# Altium project gclk_a.PrjPCB
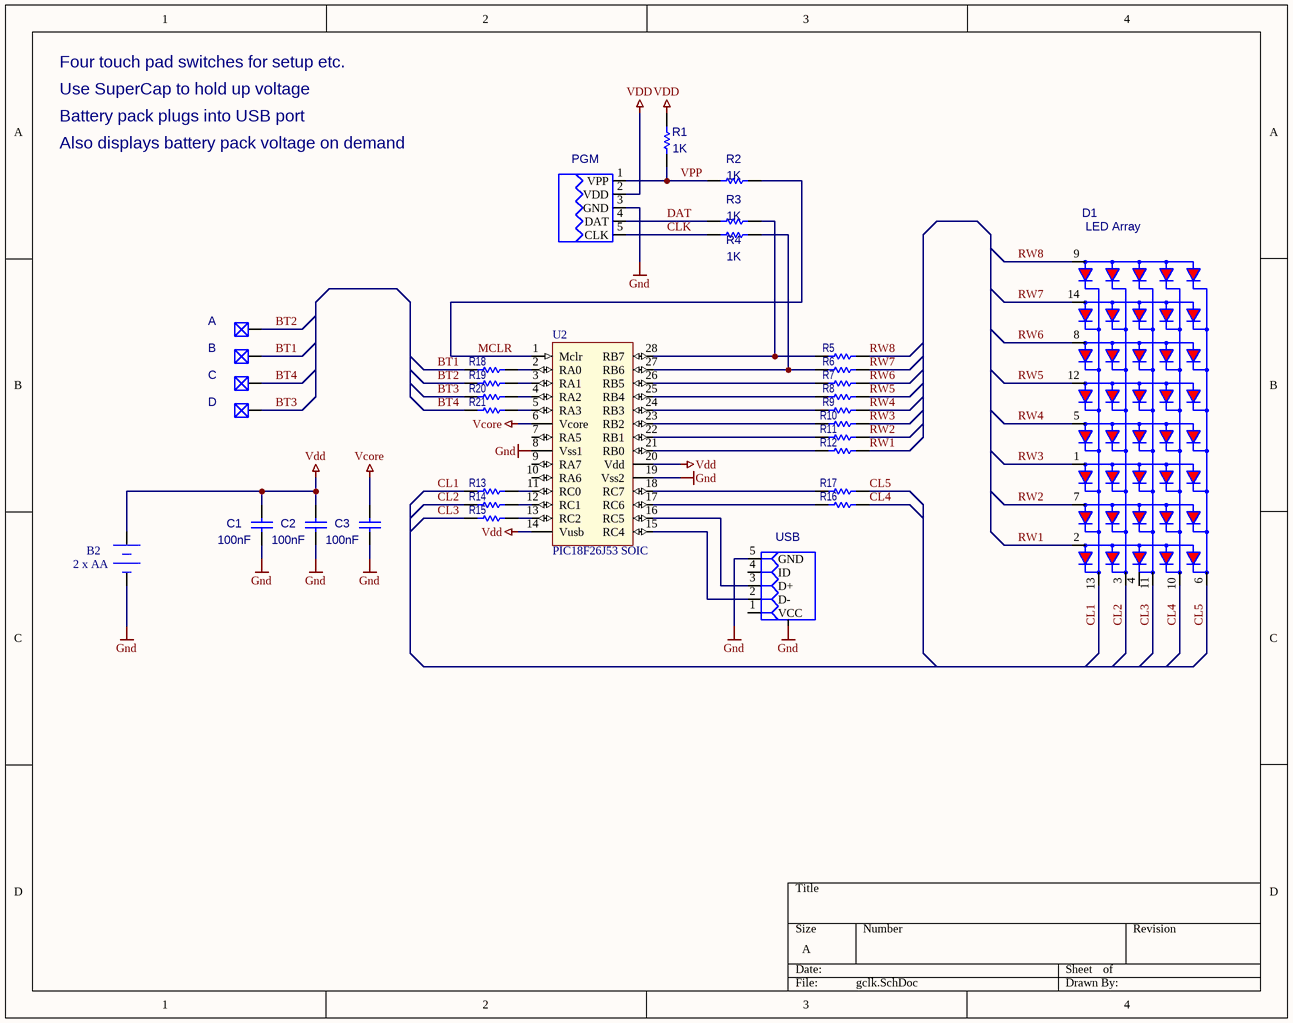
[diagram p0: gclk.SchDoc]
1 sheet, 33 parts. Net scope: global (net labels, ports and power ports of the same name join across sheets).
Board file: gclk.PcbDoc

## Sheet gclk.SchDoc
size A

### Parts
A  PAD143-190-12GA  [PAD143-190-12GA]  (value not drawn)
B  PAD143-190-12GA  [PAD143-190-12GA]  (value not drawn)
B2  2 x AA  [BC2AAPC]
C  PAD143-190-12GA  [PAD143-190-12GA]  (value not drawn)
C1  value 100nF  [CAPC0805(2012)145_N]  (hidden comment: CAP 100nF 50V 0805(2012))
C2  value 100nF  [CAPC0805(2012)145_N]  (hidden comment: CAP 100nF 50V 0805(2012))
C3  value 100nF  [CAPC0805(2012)145_N]  (hidden comment: CAP 100nF 50V 0805(2012))
D  PAD143-190-12GA  [PAD143-190-12GA]  (value not drawn)
D1  LED Array  [LTP-2158]
PGM  Program Header  [ProgHeader_100]  (value not drawn)
R1  1K  [RESC0603(1608)_L]
R2  1K  [RESC0603(1608)_L]
R3  1K  [RESC0603(1608)_L]
R4  1K  [RESC0603(1608)_L]
R5  100R  [RESC0603(1608)_L]  (value not drawn)
R6  100R  [RESC0603(1608)_L]  (value not drawn)
R7  100R  [RESC0603(1608)_L]  (value not drawn)
R8  100R  [RESC0603(1608)_L]  (value not drawn)
R9  100R  [RESC0603(1608)_L]  (value not drawn)
R10  100R  [RESC0603(1608)_L]  (value not drawn)
R11  100R  [RESC0603(1608)_L]  (value not drawn)
R12  100R  [RESC0603(1608)_L]  (value not drawn)
R13  100R  [RESC0603(1608)_L]  (value not drawn)
R14  100R  [RESC0603(1608)_L]  (value not drawn)
R15  100R  [RESC0603(1608)_L]  (value not drawn)
R16  100R  [RESC0603(1608)_L]  (value not drawn)
R17  100R  [RESC0603(1608)_L]  (value not drawn)
R18  100R  [RESC0603(1608)_L]  (value not drawn)
R19  100R  [RESC0603(1608)_L]  (value not drawn)
R20  100R  [RESC0603(1608)_L]  (value not drawn)
R21  100R  [RESC0603(1608)_L]  (value not drawn)
U2  PIC18F26J53 SOIC  [Microchip SOIC 28 Wide]
USB  USB  [105133-0001]  (value not drawn)

### Nets
Gnd: B2.0 B2.2(-) C1.1 C2.1 C3.1 PGM.3(GND) U2.8(Vss1) U2.19(Vss2) USB.0 USB.5(GND)
Vcore: C3.2 U2.6(Vcore)
VDD: B2.1(+) C1.2 C2.2 PGM.2(VDD) R1.2 U2.14(Vusb) U2.20(Vdd)
BT1: B.1 R18.1
BT2: A.1 R19.1
BT3: D.1 R20.1
BT4: C.1 R21.1
CL1: D1.13 R13.1
CL2: D1.3 R14.1
CL3: D1.11 R15.1
CL4: D1.10 R16.2
CL5: D1.6 R17.2
CLK: PGM.5(CLK) R4.2
DAT: PGM.4(DAT) R3.2
MCLR: R2.1 U2.1(Mclr)
RW1: D1.2 R12.2
RW2: D1.7 R11.2
RW3: D1.1 R10.2
RW4: D1.5 R9.2
RW5: D1.12 R8.2
RW6: D1.8 R7.2
RW7: D1.14 R6.2
RW8: D1.9 R5.2
VPP: PGM.1(VPP) R1.1 R2.2
NetR3_1: R3.1 R5.1 U2.28(RB7)
NetR4_1: R4.1 R6.1 U2.27(RB6)
NetR7_1: R7.1 U2.26(RB5)
NetR8_1: R8.1 U2.25(RB4)
NetR9_1: R9.1 U2.24(RB3)
NetR10_1: R10.1 U2.23(RB2)
NetR11_1: R11.1 U2.22(RB1)
NetR12_1: R12.1 U2.21(RB0)
NetR13_2: R13.2 U2.11(RC0)
NetR14_2: R14.2 U2.12(RC1)
NetR15_2: R15.2 U2.13(RC2)
NetR16_1: R16.1 U2.17(RC6)
NetR17_1: R17.1 U2.18(RC7)
NetR18_2: R18.2 U2.2(RA0)
NetR19_2: R19.2 U2.3(RA1)
NetR20_2: R20.2 U2.4(RA2)
NetR21_2: R21.2 U2.5(RA3)
NetU2_15: U2.15(RC4) USB.2(D-)
NetU2_16: U2.16(RC5) USB.3(D+)

Not connected (* = marked no-connect by the designer): D1 4; U2 7(RA5) 9(RA7) 10(RA6); USB 1(VCC) 4(ID)

### Notes on the sheet
- Use SuperCap to hold up voltage
- Four touch pad switches for setup etc.
- Battery pack plugs into USB port
- Also displays battery pack voltage on demand

### Library data of the parts
B2 = BC2AAPC: Battery Holder
C1-C3 = CMP-1036-04422-1: CAP 100nF 50V ±20% 0805 (2012 Metric) Thickness 1.45mm SMD; Case-Metric: 2012; Case-EIA: 0805; AS P/N: ASC_100n_0805; Tolerance: ±20%; Max Thickness: 1.45 mm; Technology: SMT; Rated Voltage: 50 V
D1 = LTP-2158: LED Matrix 5x8 2.3" Hi Effeciency Red; ModifyDate: 11/19/2010 06:25:10
PGM = ProgHeader_100: Programming header, 0.100" centres
R1-R4 = CMP-1012-00510-1: 1K 0.1W 1% 0603 (1608 Metric)  SMD; Case-Metric: 1608; Case-EIA: 0603; Value: 1000.00 Ohm; Technology: SMT; Tolerance: 1 %; Power: 0.1 W
R5-R21 = CMP-1012-00397-1: 100R 0.1W 1% 0603 (1608 Metric)  SMD; Value: 100.00 Ohm; Case-EIA: 0603; Case-Metric: 1608; Technology: SMT; Tolerance: 1 %; Power: 0.1 W
U2 = PIC18F26J53 SOIC: AS P/N: PIC18F26J53_SOIC
USB = 105133-0001: Micro USB B Receptacle Vertical Type; AS P/N: 105133-0001
A B C D = PAD143-190-12GA: ModifyDate: 11/19/2010 06:25:12; Value: *